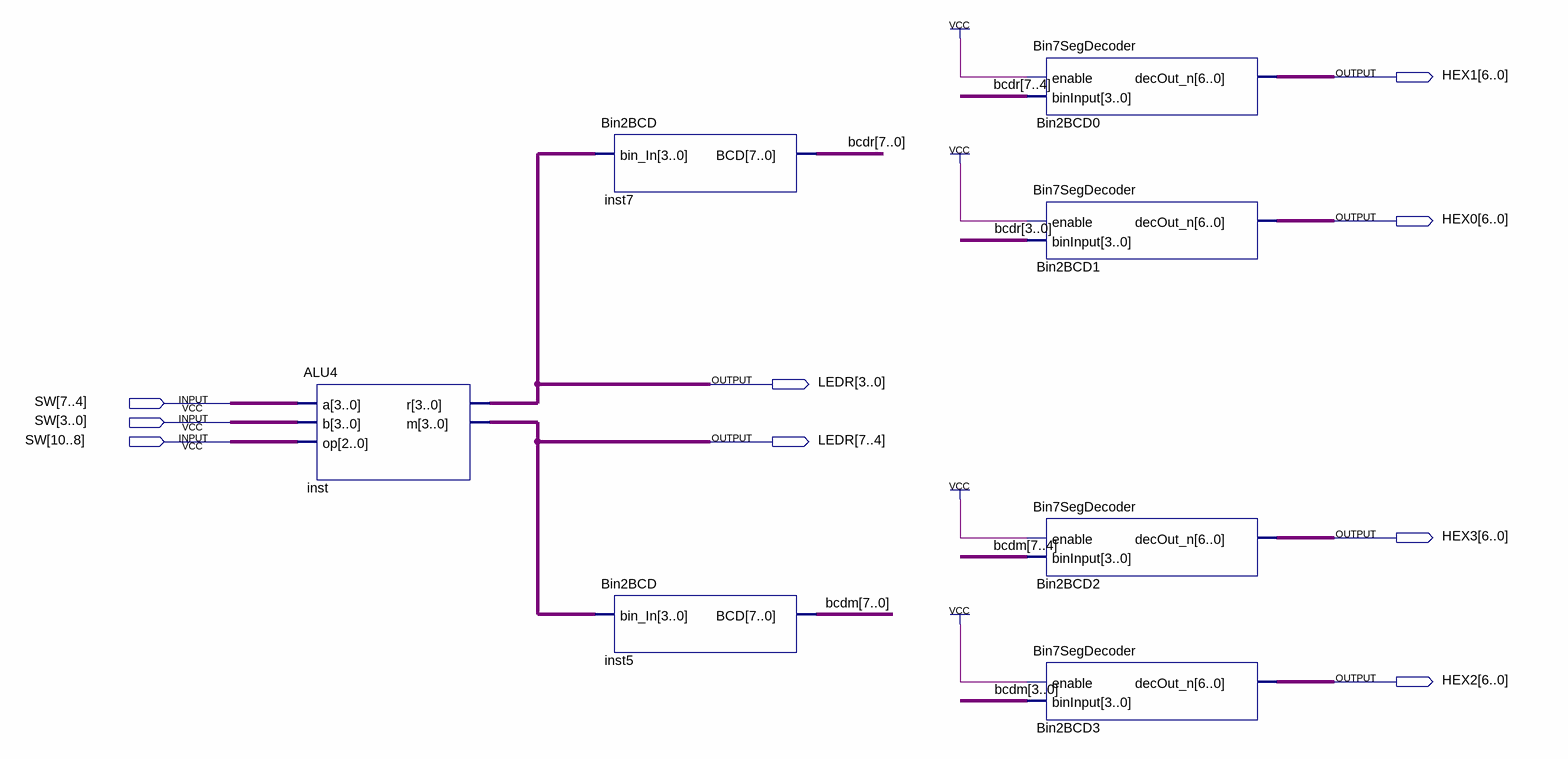
[diagram p0: schematic sheet]
// Quartus schematic ALUDemo.bdf as structural Verilog: 7 symbols, 9 pins
module ALUDemo (
  input  [10:0] SW,
  output [6:0] HEX1,
  output [6:0] HEX0,
  output [7:0] LEDR,
  output [6:0] HEX3,
  output [6:0] HEX2
);

  wire [7:0] bcdm, bcdr;

  ALU4 inst (.a(SW[7:4]), .b(SW[3:0]), .op(SW[10:8]), .r(LEDR[3:0]), .m(LEDR[7:4]));
  Bin2BCD inst7 (.bin_In(LEDR[3:0]), .BCD(bcdr));
  Bin2BCD inst5 (.bin_In(LEDR[7:4]), .BCD(bcdm));
  Bin7SegDecoder Bin2BCD0 (.enable(1'b1), .binInput(bcdr[7:4]), .decOut_n(HEX1));
  Bin7SegDecoder Bin2BCD1 (.enable(1'b1), .binInput(bcdr[3:0]), .decOut_n(HEX0));
  Bin7SegDecoder Bin2BCD2 (.enable(1'b1), .binInput(bcdm[7:4]), .decOut_n(HEX3));
  Bin7SegDecoder Bin2BCD3 (.enable(1'b1), .binInput(bcdm[3:0]), .decOut_n(HEX2));
endmodule
